# EAGLE design 11153-SandyNoble-Polarshieldv1.0 (EAGLE 5.11)
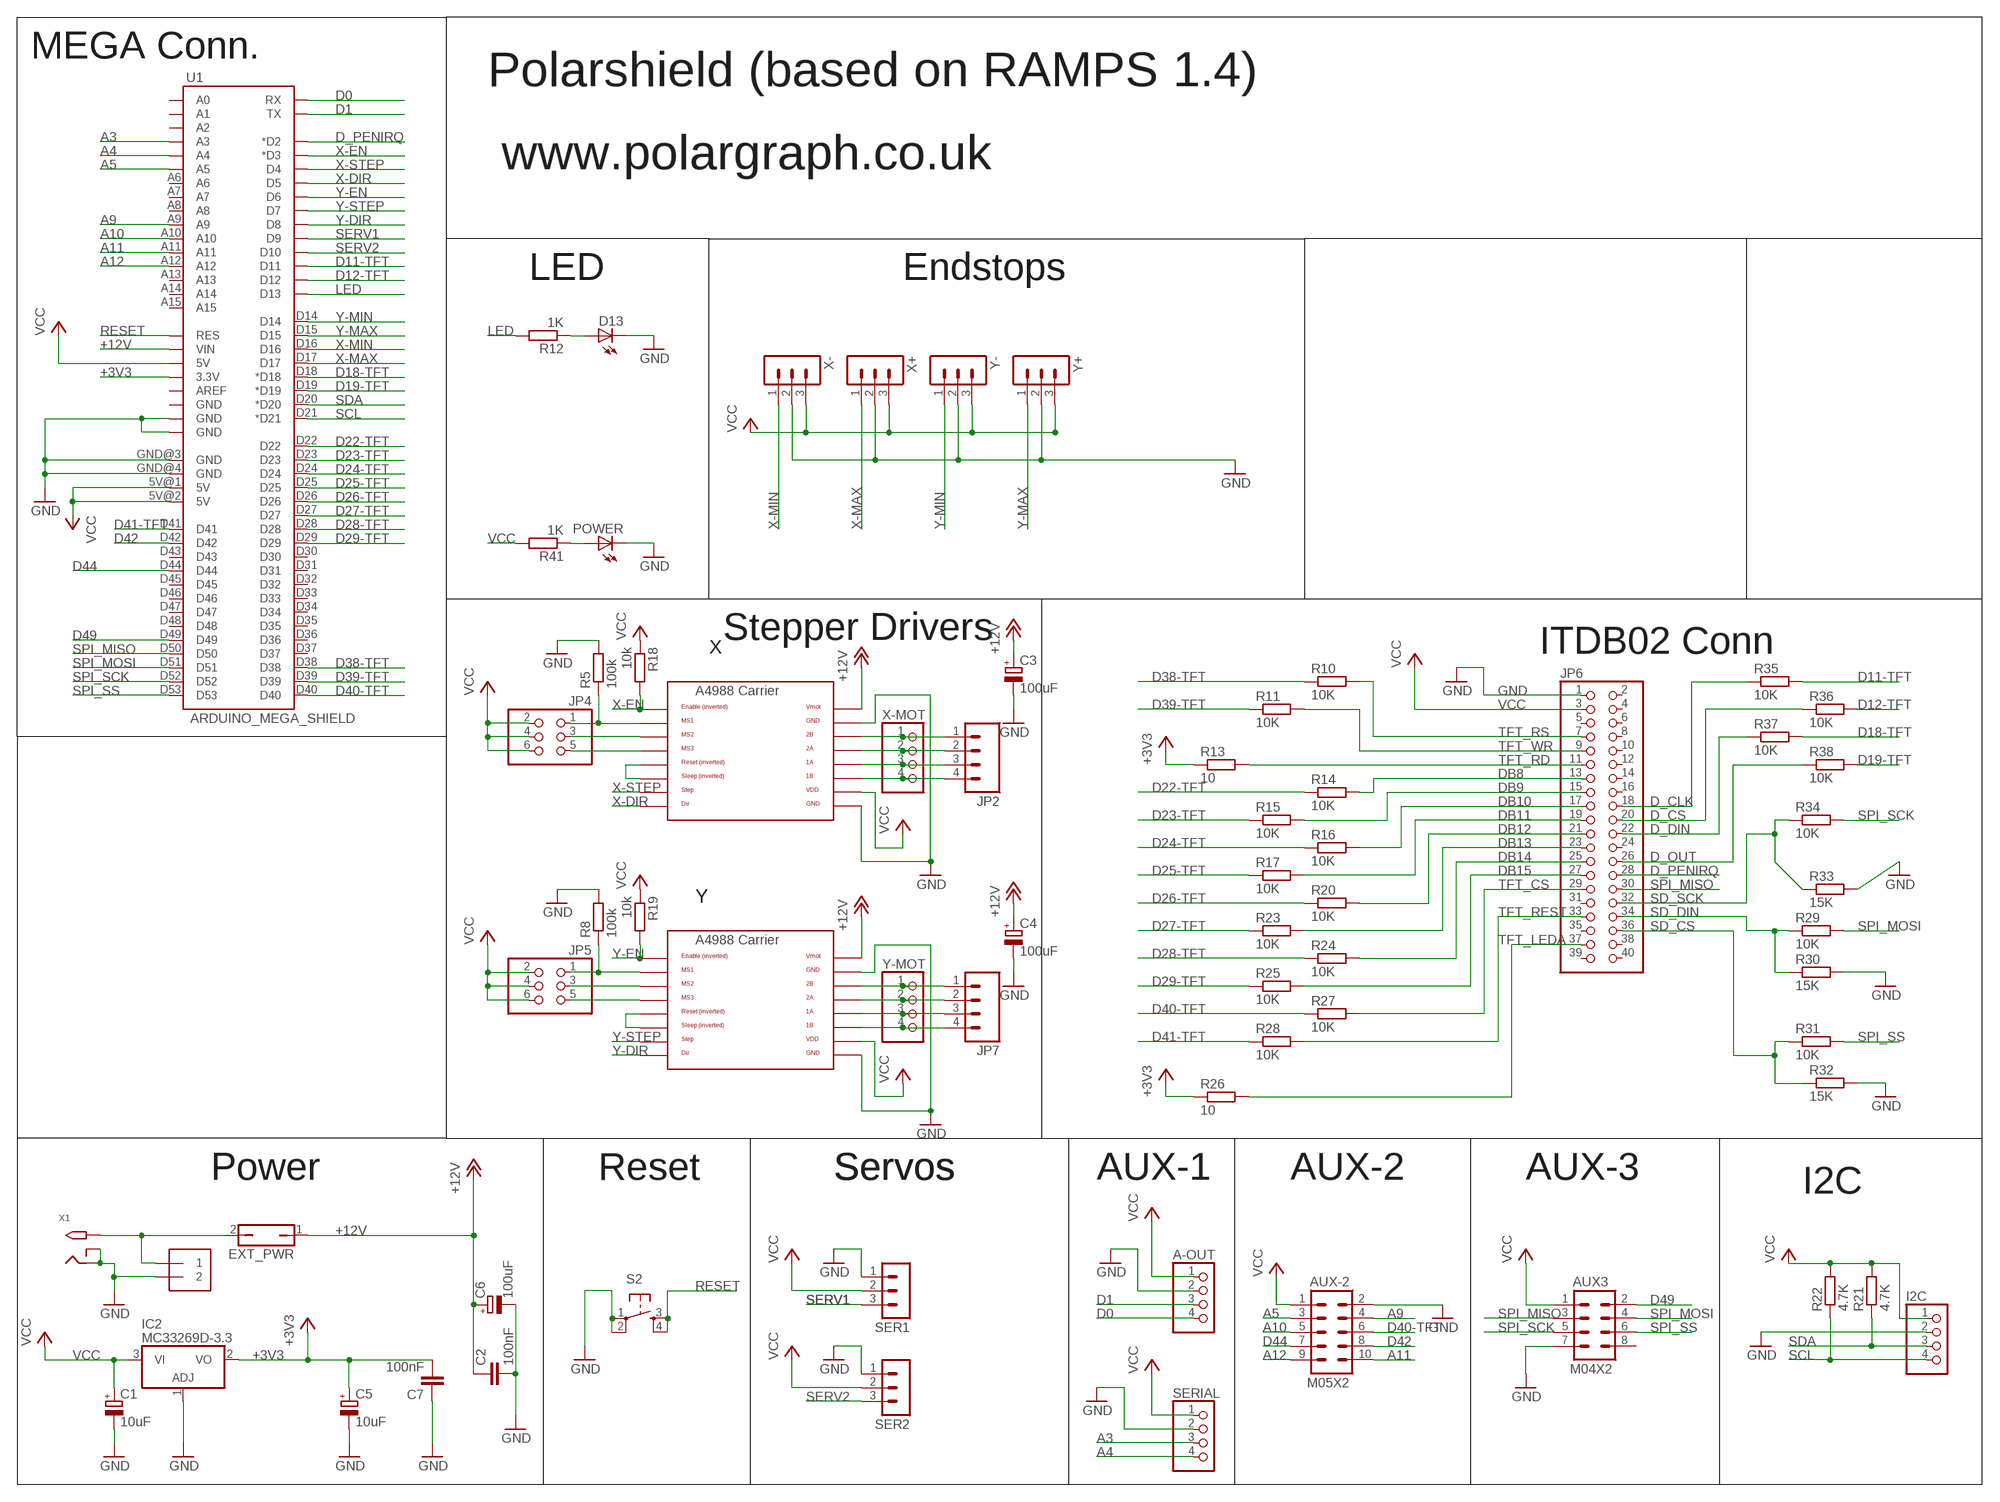
[diagram p0: schematic, sheet 1, part 1 of 2]
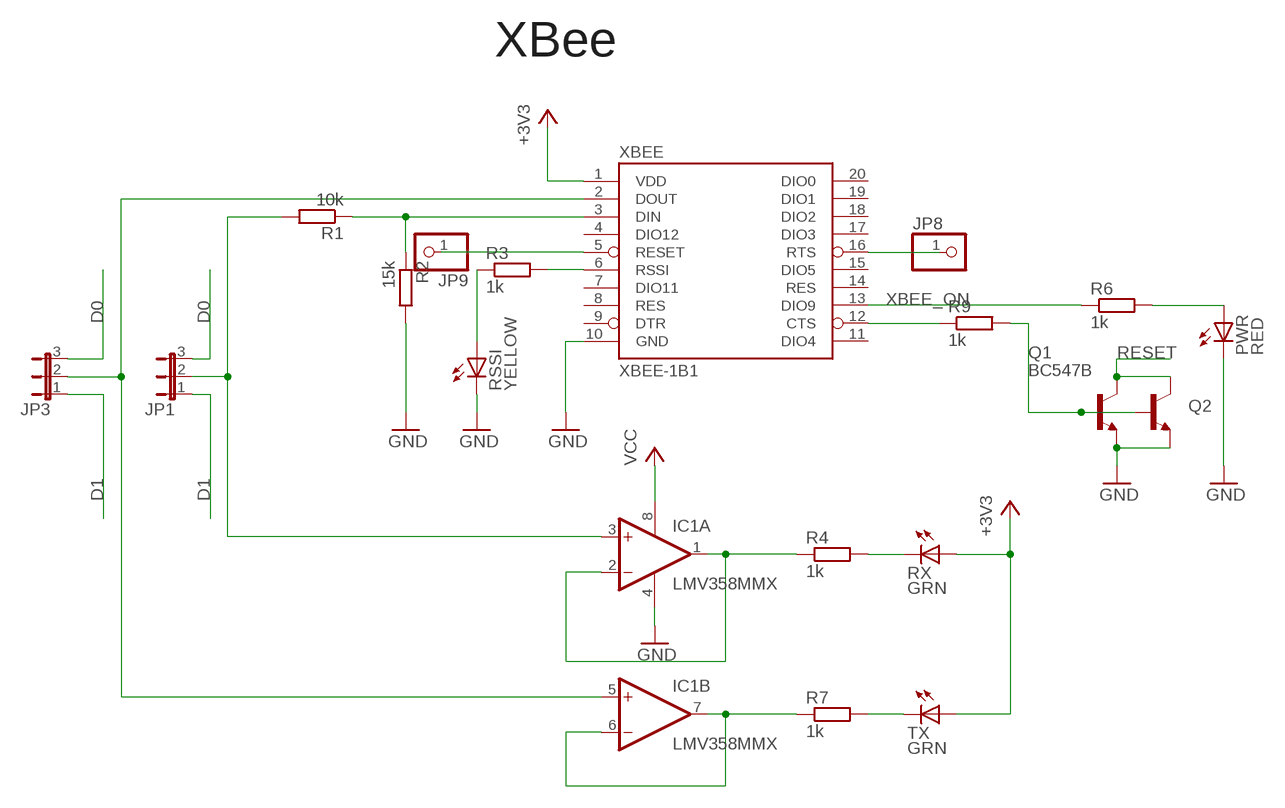
[diagram p1: schematic, sheet 1, part 2 of 2]

## Parts
A-OUT  PINHD-1X4  [1X04]
AUX3  M04X2  [2X4]
AUX-2  M05X2  [2X5]
C1  10uF  CPOL-EUCT3528  [CT3528]
C2  100nF  C-EUC0805  [C0805]
C3  100uF  CPOL-EU153CLV-0605  [153CLV-0605]
C4  100uF  CPOL-EU153CLV-0605  [153CLV-0605]
C5  10uF  CPOL-EUCT3528  [CT3528]
C6  100uF  CPOL-EU153CLV-0605  [153CLV-0605]
C7  100nF  C-EUC0805  [C0805]
D13  LEDCHIP-LED0805  [CHIP-LED0805]
EXT_PWR  JP1Q  [JP1]
I2C  PINHD-1X4  [1X04]
IC1  LMV358MMX  [MSOP08]
IC2  MC33269D-3.3  [DPACK]
J1  1X2-3.5MM  [1X2-3.5MM]
JP1  JP2E  [JP2]
JP2  M04SCREW  [SCREWTERMINAL-3.5MM-4]
JP3  JP2E  [JP2]
JP4  PINHD-2X3  [2X03]
JP5  PINHD-2X3  [2X03]
JP6  PINHD-2X20  [2X20]
JP7  M04SCREW  [SCREWTERMINAL-3.5MM-4]
JP8  PINHD-1X1  [1X01]
JP9  PINHD-1X1  [1X01]
POWER  LEDCHIP-LED0805  [CHIP-LED0805]
PWR  RED  LEDCHIPLED_0805  [CHIPLED_0805]
Q1  BC547B  [TO92]
Q2  TRANSISTOR_NPNSOT23  [SOT23]
R1  10k  R-EU_R0805  [R0805]
R2  15k  R-EU_R0805  [R0805]
R3  1k  R-EU_R0805  [R0805]
R4  1k  R-EU_R0805  [R0805]
R5  100k  R-EU_R0805  [R0805]
R6  1k  R-EU_R0805  [R0805]
R7  1k  R-EU_R0805  [R0805]
R8  100k  R-EU_R0805  [R0805]
R9  1k  R-EU_R0805  [R0805]
R10  10K  R-EU_R0805  [R0805]
R11  10K  R-EU_R0805  [R0805]
R12  1K  R-EU_R0805  [R0805]
R13  10  R-EU_R0805  [R0805]
R14  10K  R-EU_R0805  [R0805]
R15  10K  R-EU_R0805  [R0805]
R16  10K  R-EU_R0805  [R0805]
R17  10K  R-EU_R0805  [R0805]
R18  10k  R-EU_R0805  [R0805]
R19  10k  R-EU_R0805  [R0805]
R20  10K  R-EU_R0805  [R0805]
R21  4.7K  R-EU_R0805  [R0805]
R22  4.7K  R-EU_R0805  [R0805]
R23  10K  R-EU_R0805  [R0805]
R24  10K  R-EU_R0805  [R0805]
R25  10K  R-EU_R0805  [R0805]
R26  10  R-EU_R0805  [R0805]
R27  10K  R-EU_R0805  [R0805]
R28  10K  R-EU_R0805  [R0805]
R29  10K  R-EU_R0805  [R0805]
R30  15K  R-EU_R0805  [R0805]
R31  10K  R-EU_R0805  [R0805]
R32  15K  R-EU_R0805  [R0805]
R33  15K  R-EU_R0805  [R0805]
R34  10K  R-EU_R0805  [R0805]
R35  10K  R-EU_R0805  [R0805]
R36  10K  R-EU_R0805  [R0805]
R37  10K  R-EU_R0805  [R0805]
R38  10K  R-EU_R0805  [R0805]
R41  1K  R-EU_R0805  [R0805]
RSSI  YELLOW  LEDCHIPLED_0805  [CHIPLED_0805]
RX  GRN  LEDCHIPLED_0805  [CHIPLED_0805]
S2  TAC_SWITCHPTH  [TACTILE-PTH]
SER1  3PIN-HEADER  [3PIN-HEADER]
SER2  3PIN-HEADER  [3PIN-HEADER]
SERIAL  PINHD-1X4  [1X04]
TX  GRN  LEDCHIPLED_0805  [CHIPLED_0805]
U1  ARDUINO_MEGA_SHIELD  [ARDUINO_MEGA_SHIELD]
U$6  A4988BREAKOUT  [A4988BREAKOUT]
U$7  A4988BREAKOUT  [A4988BREAKOUT]
X1  2.1MMJACKTHM  [PJ-102A]
X+  3PIN-HEADER  [3PIN-HEADER]
X-  3PIN-HEADER  [3PIN-HEADER]
X-MOT  PINHD-1X4  [1X04]
XBEE  XBEE-1B1  [XBEE-1]
Y+  3PIN-HEADER  [3PIN-HEADER]
Y-  3PIN-HEADER  [3PIN-HEADER]
Y-MOT  PINHD-1X4  [1X04]

## Nets
+3V3: C5.+ C7.2 IC2.2(VO) R13.1 R26.1 RX.A TX.A U1.3.3V XBEE.1(VDD)
+12V [vcc]: C2.1 C3.+ C4.+ C6.+ EXT_PWR.1 U1.VIN U$6.VMOT U$7.VMOT
A3: SERIAL.3 U1.A3
A4: SERIAL.4 U1.A4
A5: AUX-2.3 U1.A5
A9: AUX-2.4 U1.A9
A10: AUX-2.5 U1.A10
A11: AUX-2.10 U1.A11
A12: AUX-2.9 U1.A12
D0: A-OUT.4 JP1.3 JP3.3 U1.RX
D1: A-OUT.3 JP1.1 JP3.1 U1.TX
D11-TFT: R35.2 U1.D11
D12-TFT: R36.2 U1.D12
D18-TFT: R37.2 U1.D18(*D18)
D19-TFT: R38.2 U1.D19(*D19)
D22-TFT: R14.1 U1.D22
D23-TFT: R15.1 U1.D23
D24-TFT: R16.1 U1.D24
D25-TFT: R17.1 U1.D25
D26-TFT: R20.1 U1.D26
D27-TFT: R23.1 U1.D27
D28-TFT: R24.1 U1.D28
D29-TFT: R25.1 U1.D29
D38-TFT: R10.1 U1.D38
D39-TFT: R11.1 U1.D39
D40-TFT: AUX-2.6 R27.1 U1.D40
D41-TFT: R28.1 U1.D41
D42: AUX-2.8 U1.D42
D44: AUX-2.7 U1.D44
D49: AUX3.2 U1.D49
D_CLK: JP6.18 R35.1
D_CS: JP6.20 R36.1
D_DIN: JP6.22 R37.1
D_OUT: JP6.26 R38.1
D_PENIRQ: JP6.28 U1.D2(*D2)
DB8: JP6.13 R14.2
DB9: JP6.15 R15.2
DB10: JP6.17 R16.2
DB11: JP6.19 R17.2
DB12: JP6.21 R20.2
DB13: JP6.23 R23.2
DB14: JP6.25 R24.2
DB15: JP6.27 R25.2
GND: A-OUT.2 AUX3.7 AUX-2.2 C1.- C2.2 C3.- C4.- C5.- C6.- C7.1 D13.C I2C.2 IC1.4(P:V-) IC2.1(ADJ) J1.2 JP6.1 POWER.C PWR.C Q1.1(E) Q2.2(E) R2.2 R5.2 R8.2 R30.2 R32.2 R33.2 RSSI.C S2.1 S2.2 SER1.1 SER2.1 SERIAL.2 U1.GND@0(GND) U1.GND@1(GND) U1.GND@3(GND) U1.GND@4(GND) U$6.GND U$6.GND@0(GND) U$7.GND U$7.GND@0(GND) X1.RING X1.RING_SW X+.2 X-.2 XBEE.10(GND) Y+.2 Y-.2
LED: R12.2 U1.D13
N$1: U$6.RST U$6.SLP(SLEEP)
N$2: POWER.A R41.1
N$3: EXT_PWR.2 J1.1 X1.TIP
N$4: R7.2 TX.C
N$5: R3.1 RSSI.A
N$6: IC1.6(B:-IN) IC1.7(B:OUT) R7.1
N$7: PWR.A R6.2
N$8: R3.2 XBEE.6(RSSI)
N$9: IC1.1(A:OUT) IC1.2(A:-IN) R4.1
N$10: R9.1 XBEE.12(CTS)
N$11: R4.2 RX.C
N$12: Q1.2(B) Q2.1(B) R9.2
N$13: U$7.RST U$7.SLP(SLEEP)
N$14: JP4.1 R5.1 U$6.MS1
N$15: JP4.3 U$6.MS2
N$16: IC1.3(A:+IN) JP1.2 R1.2
N$17: JP5.3 U$7.MS2
N$18: JP9.1 XBEE.5(RESET)
N$19: JP4.5 U$6.MS3
N$20: JP8.1 XBEE.16(RTS)
N$21: JP2.1 U$6.2B X-MOT.1
N$22: JP2.2 U$6.2A X-MOT.2
N$24: IC1.5(B:+IN) JP3.2 XBEE.2(DOUT)
N$26: JP2.3 U$6.1A X-MOT.3
N$27: JP2.4 U$6.1B X-MOT.4
N$28: JP7.1 U$7.2B Y-MOT.1
N$29: JP7.2 U$7.2A Y-MOT.2
N$30: JP7.3 U$7.1A Y-MOT.3
N$31: JP5.5 U$7.MS3
N$32: R1.1 R2.1 XBEE.3(DIN)
N$33: JP5.1 R8.1 U$7.MS1
N$36: JP7.4 U$7.1B Y-MOT.4
N$46: D13.A R12.1
RESET: Q1.3(C) Q2.3(C) S2.3 S2.4 U1.RES
SCL: I2C.4 R22.1 U1.D21(*D21)
SD_CS: JP6.36 R31.1 R32.1
SD_DIN: JP6.34 R29.1 R30.1
SD_SCK: JP6.32 R33.1 R34.1
SDA: I2C.3 R21.1 U1.D20(*D20)
SERV1: SER1.3 U1.D9
SERV2: SER2.3 U1.D10
SPI_MISO: AUX3.3 JP6.30 U1.D50
SPI_MOSI: AUX3.4 R29.2 U1.D51
SPI_SCK: AUX3.5 R34.2 U1.D52
SPI_SS: AUX3.6 R31.2 U1.D53
TFT_CS: JP6.29 R27.2
TFT_LEDA: JP6.37 R26.2
TFT_RD: JP6.11 R13.2
TFT_REST: JP6.33 R28.2
TFT_RS: JP6.7 R10.2
TFT_WR: JP6.9 R11.2
VCC: A-OUT.1 AUX3.1 AUX-2.1 C1.+ I2C.1 IC1.8(P:V+) IC2.3(VI) JP4.2 JP4.4 JP4.6 JP5.2 JP5.4 JP5.6 JP6.3 R18.1 R19.1 R21.2 R22.2 R41.2 SER1.2 SER2.2 SERIAL.1 U1.5V@0(5V) U1.5V@1(5V) U1.5V@2(5V) U$6.VDD U$7.VDD X+.3 X-.3 Y+.3 Y-.3
X-DIR: U1.D5 U$6.DIR
X-EN: R18.2 U1.D3(*D3) U$6.EN
X-MAX: U1.D17 X+.1
X-MIN: U1.D16 X-.1
X-STEP: U1.D4 U$6.STEP
XBEE_ON: R6.1 XBEE.13(DIO9)
Y-DIR: U1.D8 U$7.DIR
Y-EN: R19.2 U1.D6 U$7.EN
Y-MAX: U1.D15 Y+.1
Y-MIN: U1.D14 Y-.1
Y-STEP: U1.D7 U$7.STEP
Unconnected: AUX3.8 JP6.2 JP6.4 JP6.5 JP6.6 JP6.8 JP6.10 JP6.12 JP6.14 JP6.16 JP6.24 JP6.31 JP6.35 JP6.38 JP6.39 JP6.40 U1.A0 U1.A1 U1.A2 U1.A6 U1.A7 U1.A8 U1.A13 U1.A14 U1.A15 U1.AREF U1.D30 U1.D31 U1.D32 U1.D33 U1.D34 U1.D35 U1.D36 U1.D37 U1.D43 U1.D45 U1.D46 U1.D47 U1.D48 U1.GND@2(GND) XBEE.4(DIO12) XBEE.7(DIO11) XBEE.8(RES) XBEE.9(DTR) XBEE.11(DIO4) XBEE.14(RES) XBEE.15(DIO5) XBEE.17(DIO3) XBEE.18(DIO2) XBEE.19(DIO1) XBEE.20(DIO0)

## Notes on the sheet
- MEGA Conn.
- Polarshield (based on RAMPS 1.4)
- www.polargraph.co.uk
- LED | Endstops
- XBee
- Stepper Drivers
- X | ITDB02 Conn
- Y
- Power | Reset | Servos | Servos | AUX-1 | AUX-2 | AUX-3
- I2C

## Library data of the parts
A-OUT I2C SERIAL X-MOT Y-MOT = RepRapjr:PINHD-1X4: PIN HEADER
AUX3 = SparkFun:M04X2
AUX-2 = RepRapjr:M05X2
C1 C3-C6 = rcl:CPOL-EU: POLARIZED CAPACITOR, European symbol
C2 C7 = resistor:C-EU: CAPACITOR, European symbol
D13 POWER PWR RSSI RX TX = led:LED: LED OSRAM: - CHIPLED LG R971, LG N971, LY N971, LG Q971, LY Q971, LO R971, LY R971 LH N974, LH R974 LS Q976, LO Q976, LY Q976 LO Q996 - Hyper CHIPLED LW Q18S LB Q993, LB Q99A, LB R99A - SideLED LS A670, LO A670, LY A670, LG A670, LP A670 LB A673, LV A673, LT A673, LW A673 LH A674 LY A675 LS A676, LA A676, LO A676, LY A676, LW A676 LS A679, LY A679, LG A679 - Hyper Micro SIDELED® LS Y876, LA Y876, LO Y876, LY Y876 LT Y87S - SmartLED LW L88C, LW L88S LB L89C, LB L89S, LG L890 LS L89K, LO L89K, LY L89K LS L896, LA L896, LO L896, LY L896 - TOPLED LS T670, LO T670, LY T670, LG T670, LP T670 LSG T670, LSP T670, LSY T670, LOP T670, LYG T670 LG T671, LOG T671, LSG T671 LB T673, LV T673, LT T673, LW T673 LH T674 LS T676, LA T676, LO T676, LY T676, LB T676, LH T676, LSB T676, LW T676 LB T67C, LV T67C, LT T67C, LS T67K, LO T67K, LY T67K, LW E67C LS E67B, LA E67B, LO E67B, LY E67B, LB E67C, LV E67C, LT E67C LW T67C LS T679, LY T679, LG T679 LS T770, LO T770, LY T770, LG T770, LP T770 LB T773, LV T773, LT T773, LW T773 LH T774 LS E675, LA E675, LY E675, LS T675 LS T776, LA T776, LO T776, LY T776, LB T776 LHGB T686 LT T68C, LB T68C - Hyper Mini TOPLED® LB M676 - Mini TOPLED Santana® LG M470 LS M47K, LO M47K, LY M47K Source: http://www.osram.convergy.de LUXEON: - LUMILED® LXK2-PW12-R00, LXK2-PW12-S00, LXK2-PW14-U00, LXK2-PW14-V00 LXK2-PM12-R00, LXK2-PM12-S00, LXK2-PM14-U00 LXK2-PE12-Q00, LXK2-PE12-R00, LXK2-PE12-S00, LXK2-PE14-T00, LXK2-PE14-U00 LXK2-PB12-K00, LXK2-PB12-L00, LXK2-PB12-M00, LXK2-PB14-N00, LXK2-PB14-P00, LXK2-PB14-Q00 LXK2-PR12-L00, LXK2-PR12-M00, LXK2-PR14-Q00, LXK2-PR14-R00 LXK2-PD12-Q00, LXK2-PD12-R00, LXK2-PD12-S00 LXK2-PH12-R00, LXK2-PH12-S00 LXK2-PL12-P00, LXK2-PL12-Q00, LXK2-PL12-R00 Source: www.luxeon.com KINGBRIGHT: KA-3528ASYC Source: www.kingbright.com
EXT_PWR = jumper:JP1Q: JUMPER
IC1 = linear:LMV358?*: Dual General Purpose, Low Voltage, Rail-to-Rail Output Operational Amplifiers Source: http://www.national.com/mpf/LM/LMV321.html http://www.national.com/dt/lmv_qual.pdf
IC2 = linear:MC33269?*: Adjustable Output Low Dropout Voltage Regulator 800 mA Source: http://www.onsemi.com/pub/Collateral/MC33269-D.PDF
J1 = adafruit:1X2: 3.5mm Terminal block http://www.ladyada.net/library/pcb/eaglelibrary.html
JP1 JP3 = jumper:JP2E: JUMPER
JP2 JP7 = SparkFun:M04: Header 4 Standard 4-pin 0.1" header. Use with straight break away headers (SKU : PRT-00116), right angle break away headers (PRT-00553), swiss pins (PRT-00743), machine pins (PRT-00117), and female headers (PRT-00115). Molex polarized connector foot print use with SKU : PRT-08231 with associated crimp pins and housings. 1MM SMD Version SKU: PRT-10208
JP4 JP5 = pinhead:PINHD-2X3: PIN HEADER
JP6 = pinhead:PINHD-2X20: PIN HEADER
JP8 JP9 = adafruit:PINHD-1X1: Pin header 1x1 for 0.1" spacing With round pins
Q1 = transistor-npn:BC547*: NPN Transistor
Q2 = SparkFun:TRANSISTOR_NPN: Transistor NPN BJT configuration in SOT23 package. MMBT2222 is the common NPN we use. Double check BCE configuration again layout.
R1 R2 R5 R8 R12 R18 R19 R21 R22 R41 = rcl:R-EU_: RESISTOR, European symbol
R3 R4 R6 R7 R9-R11 R13-R17 R20 R23-R38 = resistor:R-EU_: RESISTOR, European symbol
S2 = SparkFun:TAC_SWITCH: Momentary Switch Button commonly used for reset or general input. Spark Fun Electronics SKU : COM-00097
SER1 SER2 X+ X- Y+ Y- = ultimachine:3PIN-HEADER: PIN HEADER
U1 = RepRapjr:ARDUINO_MEGA_SHIELD
U$6 U$7 = RepRapjr:A4988BREAKOUT
X1 = adafruit:2.1MMJACK: 2.1mm x 5.5mm THM DC jack with internal switch. Digikey part #PJ-102A, 4UCON part #05537 2.1mm x 5.5mm SMT DC jack with internal switch. Digikey part #PJ-002A-SMT, 4UCON part #03267 By microbuilder.eu & adafruit.com
XBEE = SparkFun:XBEE-1

## Net classes
1 gnd12: width 2.54 mm
2 gnd5: width 2.54 mm
3 vmot: width 2.54 mm
4 vcc: width 0.406 mm
5 signal: width 0.406 mm

## Board
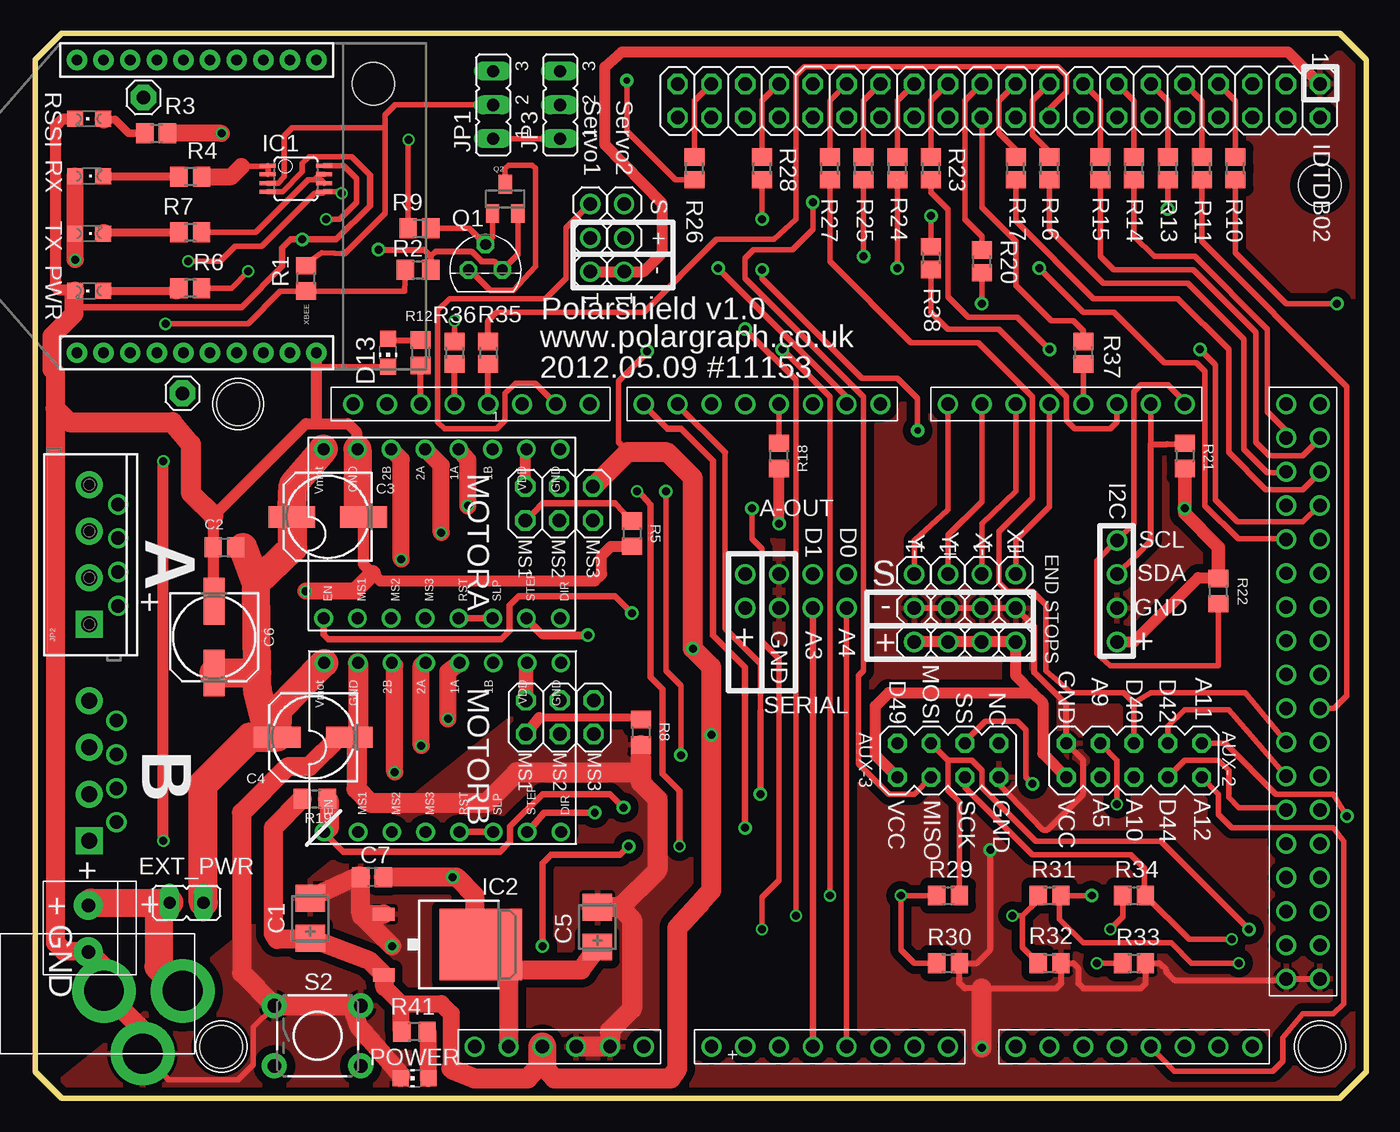
[diagram p2: board, top side]
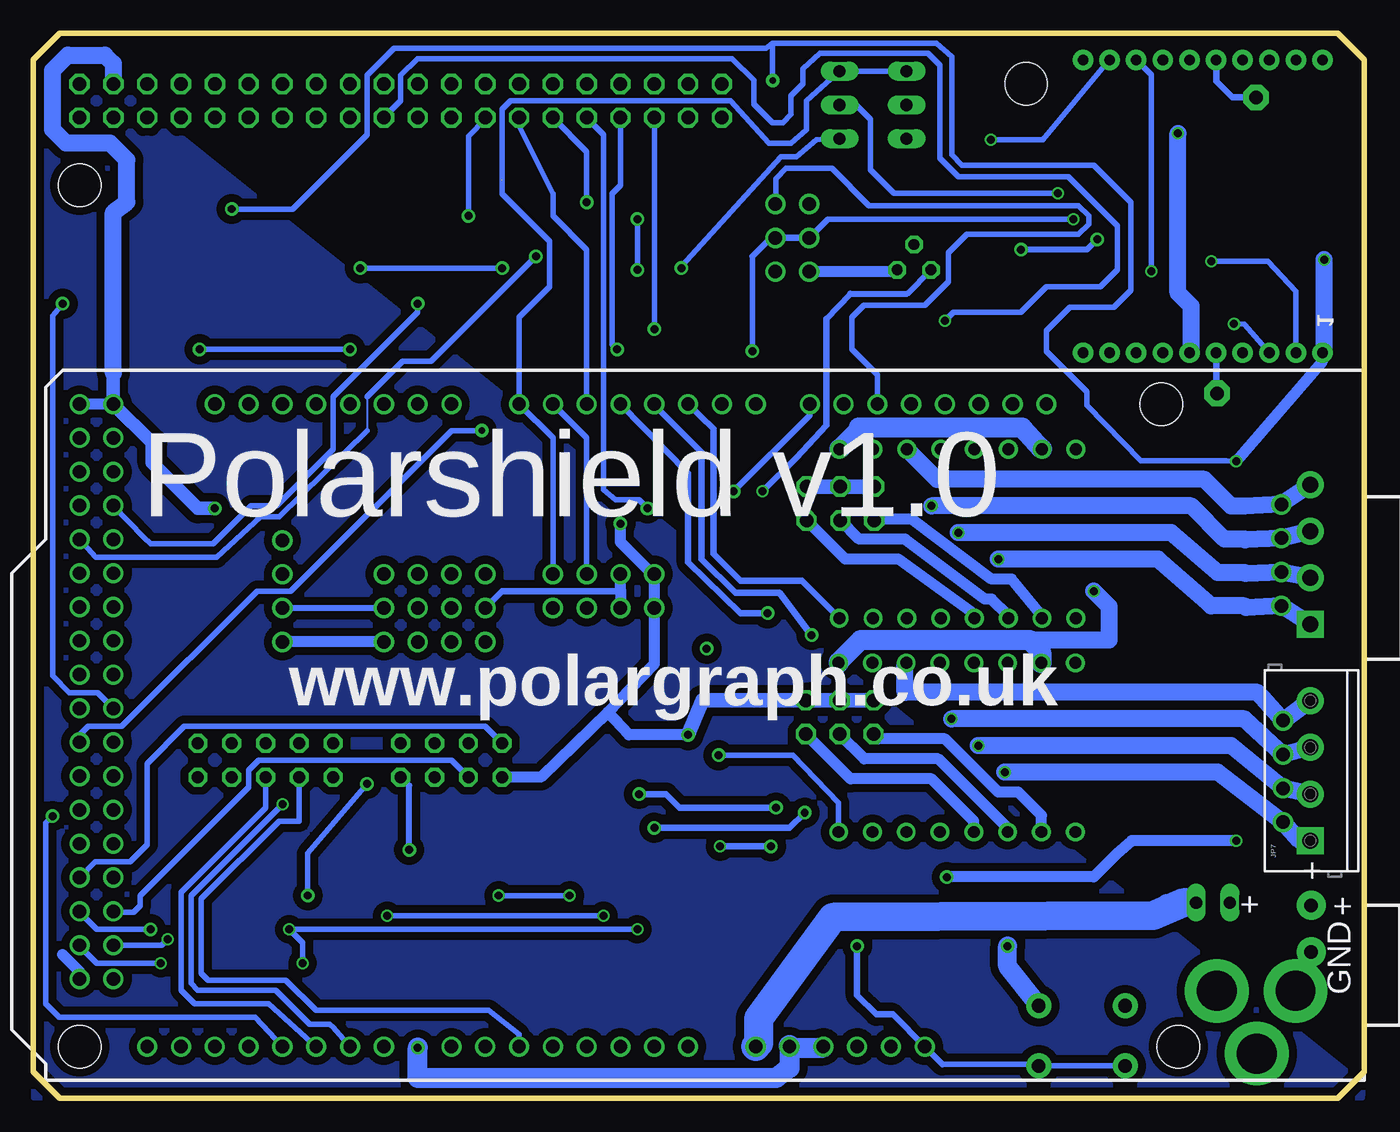
[diagram p3: board, bottom side, seen from below]

Size 100 x 80 mm. Coordinates in mm from the lower left corner, seen from the top.
Outline: 100,2 100,78 98,80 2,80 0,78 0,2 2,0 98,0 100,2
Copper layers (1*16): Top 0.035mm / dielectric 1.5mm / Bottom 0.035mm
Design rules "ITead_rule": minimum track width 6mil, minimum drill 12mil, track to track 6mil, track to pad 6mil, pad to pad 6mil, via to via 6mil, smd to smd 0mil, copper to edge 10mil, drill to drill 10mil, minimum pad ring 10mil, minimum via ring 6mil, stop-mask expansion 2mil, vias tented up to drill 100mil, thermal gap 10mil
Holes 3.2 mm at 25.4,76.2 96.52,68.58

### Footprints (pad centres in the part's own frame; a part is rotated, then mirrored left to right if it is on the bottom)
1X04 = drill 1.016 round: 1 -2.54,0; 2 0,0; 3 2.54,0; 4 5.08,0
2X4 = drill 0.9 pad 1.422 octagon: 1 -3.81,-1.27; 2 -3.81,1.27; 3 -1.27,-1.27; 4 -1.27,1.27; 5 1.27,-1.27; 6 1.27,1.27; 7 3.81,-1.27; 8 3.81,1.27
2X5 = drill 0.9 pad 1.422 octagon: 1 -3.81,-1.27; 2 -3.81,1.27; 3 -1.27,-1.27; 4 -1.27,1.27; 5 1.27,-1.27; 6 1.27,1.27; 7 3.81,-1.27; 8 3.81,1.27; 9 6.35,-1.27; 10 6.35,1.27
CT3528 = smd 2 x 2.2: + -1.5,0; - 1.5,0
C0805 = smd 1.3 x 1.5: 1 -0.85,0; 2 0.85,0
153CLV-0605 = smd 3.5 x 1.6: + 2.7,0; - -2.7,0
CHIP-LED0805 = smd 1.2 x 1.2: A 0,-1.05; C 0,1.05
JP1 = drill 0.914 long: 1 0,-1.27; 2 0,1.27
MSOP08 = smd 0.3 x 1.2: 1 -0.976,-2.113; 2 -0.326,-2.113; 3 0.324,-2.113; 4 0.974,-2.113; 5 0.974,2.112; 6 0.324,2.112; 7 -0.326,2.112; 8 -0.976,2.112
DPACK = smd 1 x 1.6: 1 -2.28,-4.8; 3 2.28,-4.8 | smd 5.4 x 6.2: 2 0,2.5
1X2-3.5MM = drill 1 pad 2.184 round: 1 1.8,0; 2 -1.7,0
JP2 = drill 0.914 long: 1 -2.54,0; 2 0,0; 3 2.54,0
SCREWTERMINAL-3.5MM-4 = drill 1.2 pad 2.032 square: 1 0,0 | drill 1.2 pad 2.032 round: 2 3.5,0; 3 7,0; 4 10.5,0
2X03 = drill 1.016 octagon: 1 -2.54,-1.27; 2 -2.54,1.27; 3 0,-1.27; 4 0,1.27; 5 2.54,-1.27; 6 2.54,1.27
2X20 = drill 1.016 octagon: 1 -24.13,-1.27; 2 -24.13,1.27; 3 -21.59,-1.27; 4 -21.59,1.27; 5 -19.05,-1.27; 6 -19.05,1.27; 7 -16.51,-1.27; 8 -16.51,1.27; 9 -13.97,-1.27; 10 -13.97,1.27; 11 -11.43,-1.27; 12 -11.43,1.27; 13 -8.89,-1.27; 14 -8.89,1.27; 15 -6.35,-1.27; 16 -6.35,1.27; 17 -3.81,-1.27; 18 -3.81,1.27; 19 -1.27,-1.27; 20 -1.27,1.27; 21 1.27,-1.27; 22 1.27,1.27; 23 3.81,-1.27; 24 3.81,1.27; 25 6.35,-1.27; 26 6.35,1.27; 27 8.89,-1.27; 28 8.89,1.27; 29 11.43,-1.27; 30 11.43,1.27; 31 13.97,-1.27; 32 13.97,1.27; 33 16.51,-1.27; 34 16.51,1.27; 35 19.05,-1.27; 36 19.05,1.27; 37 21.59,-1.27; 38 21.59,1.27; 39 24.13,-1.27; 40 24.13,1.27
1X01 = drill 1.016 pad 1.93 octagon: 1 0,0
CHIPLED_0805 = smd 1.2 x 1.2: A 0,-1.05; C 0,1.05
TO92 = drill 0.813 octagon: 1 1.27,0; 2 0,1.905; 3 -1.27,0
SOT23 = smd 1 x 1.4: 1 -0.95,-1.1; 2 0.95,-1.1; 3 0,1.1
R0805 = smd 1.3 x 1.5: 1 -0.95,0; 2 0.95,0
R0805' = smd 1.3 x 1.5: 1 -0.85,0; 2 0.85,0
TACTILE-PTH = drill 1.016 pad 1.88 round: 1 -3.251,2.261; 2 3.251,2.261; 3 -3.251,-2.261; 4 3.251,-2.261
3PIN-HEADER = drill 1.016 round: 1 -2.54,0; 2 0,0; 3 2.54,0
ARDUINO_MEGA_SHIELD = drill 1 pad 1.422 round: 3.3V 35.56,2.54; 5V@0 38.1,2.54; 5V@1 93.98,50.8; 5V@2 96.52,50.8; A0 50.8,2.54; A1 53.34,2.54; A2 55.88,2.54; A3 58.42,2.54; A4 60.96,2.54; A5 63.5,2.54; A6 66.04,2.54; A7 68.58,2.54; A8 73.66,2.54; A9 76.2,2.54; A10 78.74,2.54; A11 81.28,2.54; A12 83.82,2.54; A13 86.36,2.54; A14 88.9,2.54; A15 91.44,2.54; AREF 23.876,50.8; D2 58.42,50.8; D3 55.88,50.8; D4 53.34,50.8; D5 50.8,50.8; D6 48.26,50.8; D7 45.72,50.8; D8 41.656,50.8; D9 39.116,50.8; D10 36.576,50.8; D11 34.036,50.8; D12 31.496,50.8; D13 28.956,50.8; D14 68.58,50.8; D15 71.12,50.8; D16 73.66,50.8; D17 76.2,50.8; D18 78.74,50.8; D19 81.28,50.8; D20 83.82,50.8; D21 86.36,50.8; D22 93.98,48.26; D23 96.52,48.26; D24 93.98,45.72; D25 96.52,45.72; D26 93.98,43.18; D27 96.52,43.18; D28 93.98,40.64; D29 96.52,40.64; D30 93.98,38.1; D31 96.52,38.1; D32 93.98,35.56; D33 96.52,35.56; D34 93.98,33.02; D35 96.52,33.02; D36 93.98,30.48; D37 96.52,30.48; D38 93.98,27.94; D39 96.52,27.94; D40 93.98,25.4; D41 96.52,25.4; D42 93.98,22.86; D43 96.52,22.86; D44 93.98,20.32; D45 96.52,20.32; D46 93.98,17.78; D47 96.52,17.78; D48 93.98,15.24; D49 96.52,15.24; D50 93.98,12.7; D51 96.52,12.7; D52 93.98,10.16; D53 96.52,10.16; GND@0 40.64,2.54; GND@1 43.18,2.54; GND@2 26.416,50.8; GND@3 93.98,7.62; GND@4 96.52,7.62; RES 33.02,2.54; RX 63.5,50.8; TX 60.96,50.8; VIN 45.72,2.54 | hole 3.2: 96.52,2.54; 13.97,2.54; 15.24,50.8
A4988BREAKOUT = drill 0.9 round: 1A 8.89,1.27; 1B 11.43,1.27; 2A 6.35,1.27; 2B 3.81,1.27; DIR 16.51,-11.43; EN -1.27,-11.43; GND 16.51,1.27; GND@0 1.27,1.27; MS1 1.27,-11.43; MS2 3.81,-11.43; MS3 6.35,-11.43; RST 8.89,-11.43; SLP 11.43,-11.43; STEP 13.97,-11.43; VDD 13.97,1.27; VMOT -1.27,1.27
PJ-102A = drill 3 pad 4.8 round: RING 0.1,-3.39; RING_SW -4.6,-6.29; TIP 0.1,-9.29
XBEE-1 = drill 0.8 pad 1.524 round: 1 -11,20; 2 -11,18; 3 -11,16; 4 -11,14; 5 -11,12; 6 -11,10; 7 -11,8; 8 -11,6; 9 -11,4; 10 -11,2; 11 11,2; 12 11,4; 13 11,6; 14 11,8; 15 11,10; 16 11,12; 17 11,14; 18 11,16; 19 11,18; 20 11,20

### Placement (x,y rotation side)
A-OUT  55.88,39.37 0 top
AUX3  68.58,25.4 0 top
AUX-2  81.28,25.4 0 top
C1  20.67,13.53 90 top
C2  14.21,41.39 180 top
C3  21.97,43.68 180 top
C4  20.89,27.13 180 top
C5  42.23,12.86 90 top
C6  13.44,34.64 270 top
C7  25.31,16.62 0 top
D13  26.5,56 180 top
EXT_PWR  11.36,14.71 90 top
I2C  81.28,36.83 90 top
IC1  19.58,69.07 270 top
IC2  30.99,11.56 270 top
J1  3.99,12.7 90 top
JP1  34.38,74.62 90 top
JP2  4.06,35.6 90 top
JP3  39.42,74.62 90 top
JP4  39.36,44.68 0 top
JP5  39.41,28.63 0 top
JP6  72.39,74.93 180 top
JP7  4.06,19.36 90 bottom
JP8  8.13,75.18 0 top
JP9  11.05,52.96 0 top
POWER  28.5,1.5 90 top
PWR  4.04,60.65 90 top
Q1  33.82,62.23 0 top
Q2  35.31,67.56 0 top
R1  20.34,61.59 90 top
R2  28.76,62.23 0 top
R3  1k  [R0805']  9.09,72.48 0 top
R4  1k  [R0805']  11.65,69.23 180 top
R5  44.83,42.42 270 top
R6  1k  [R0805']  11.65,60.85 180 top
R7  1k  [R0805']  11.65,65.04 180 top
R8  45.5,27.5 270 top
R9  1k  [R0805']  28.86,65.35 0 top
R10  10K  [R0805']  90.17,69.85 90 top
R11  10K  [R0805']  87.63,69.85 90 top
R12  28.96,56.01 270 top
R13  10  [R0805']  85.09,69.85 90 top
R14  10K  [R0805']  82.55,69.85 90 top
R15  10K  [R0805']  80.01,69.85 90 top
R16  10K  [R0805']  76.2,69.85 90 top
R17  10K  [R0805']  73.66,69.85 90 top
R18  55.88,48.26 90 top
R19  21,22.5 0 top
R20  10K  [R0805']  71.12,62.87 90 top
R21  86.36,48.26 270 top
R22  88.9,38.1 90 top
R23  10K  [R0805']  67.31,69.85 90 top
R24  10K  [R0805']  64.77,69.85 90 top
R25  10K  [R0805']  62.23,69.85 90 top
R26  10  [R0805']  49.53,69.85 90 top
R27  10K  [R0805']  59.69,69.85 90 top
R28  10K  [R0805']  54.61,69.85 90 top
R29  10K  [R0805']  68.58,15.24 0 top
R30  15K  [R0805']  68.58,10.16 0 top
R31  10K  [R0805']  76.2,15.24 0 top
R32  15K  [R0805']  76.2,10.16 0 top
R33  15K  [R0805']  82.55,10.16 0 top
R34  10K  [R0805']  82.55,15.24 0 top
R35  10K  [R0805']  34.04,56.01 270 top
R36  10K  [R0805']  31.5,56.01 270 top
R37  10K  [R0805']  78.74,56.01 270 top
R38  10K  [R0805']  67.31,63.12 270 top
R41  28.49,5 180 top
RSSI  4.04,73.58 90 top
RX  4.04,69.27 270 top
S2  21.21,4.7 0 top
SER1  41.7,64.63 90 top
SER2  44.24,64.64 90 top
SERIAL  55.88,36.83 0 top
TX  4.04,64.96 270 top
U1  0,1.35 0 top
U$6  22.93,47.49 0 top
U$7  22.98,31.44 0 top
X1  1.77,7.97 90 top
X+  73.66,36.83 270 top
X-  71.12,36.83 270 top
X-MOT  6.22,39.54 90 top
XBEE  23.13,67 90 top
Y+  68.58,36.83 270 top
Y-  66.04,36.83 270 top
Y-MOT  6.1,23.29 90 top

### Tracks (layer width: path | path; a pad name or v marks a point on that pad's centre or on a via)
+3V3  (via drill 0.5 pad 1.02, 0.6, 0.6 pad 1.02)
  Top 0.406: v85.09,66.8 R13.1 | R26.1 48.09,69 44.45,72.64 v44.45,76.45
  Top 0.813: v9.63,19.36 v9.63,47.86
  Top 1.27: v3,63 v2.99,63.01 TX.A RX.A
  Top 1.422: 35.56,10.16 U1.3.3V | 35.56,10.16 34.88,10.16 IC2.2 33.02,12.03 33.02,15.24 31.64,16.62 v31.37,16.62 C7.2 | C5.+ 41.02,9.65 36.07,9.65 35.56,10.16
  Bottom 0.406: v9.63,47.86 10.41,47.88 16.76,47.88 20.83,52.07 20.83,53.09 23.88,56.13 23.88,57.66 22.1,59.44 18.8,59.44 17.53,60.71 17.53,67.31 20.32,70.1 30.23,70.1 30.99,70.87 30.99,78.23 32.13,79.25 44.45,79.25 | v85.09,66.8 80.52,66.8 74.93,72.39 74.93,76.83 72.9,78.87 44.96,78.87 44.45,79.25 | 44.45,79.25 v44.45,76.45
  Bottom 0.813: XBEE.1 3.13,55.37 v9.63,47.86 | v9.63,19.36 17.48,19.36 18.58,18.38 20.32,16.64 31.35,16.64 v31.37,16.62
  Bottom 1.27: v3,63 3,56.13 XBEE.1
+12V
  Top 1.27: 17.5,27.13 17.56,27.19 | C3.+ 20.06,43.89 | 15.61,41.39 C2.1
  Top 1.676: 19.35,43.68 C3.+
  Top 2.1: 18.21,29.16 U$7.VMOT | 16.67,30.74 16.66,32.01 16.61,38.74
  Top 2.184: 18.21,29.16 C4.+ 17.5,27.13 16.13,27.13 12.6,23.6 EXT_PWR.1 | U$6.VMOT 19.37,46.09 C3.+ | 17.56,27.19 16.67,30.74 | 19.35,43.68 19.35,41.35 16.61,38.74 15.61,41.39 | C6.+ 16.59,31.94 16.66,32.01
  Bottom 1.422: 13.46,14.73 14.86,14.63 EXT_PWR.1
  Bottom 2.184: U1.VIN 45.5,4.17 45.5,6 39.93,13.6 15.89,13.73 15.86,13.73 13.46,14.73
A3
  Top 0.5: U1.A3 SERIAL.3
  Bottom 0.152: U1.A3 58.42,3.81
A4
  Top 0.406: U1.A4 SERIAL.4
A5
  Bottom 0.406: U1.A5 63.5,4.83 65.79,6.6 78.74,6.6 81.03,8.89 86.87,8.89 87.38,9.4 87.38,14.99 81.53,20.83 80.01,20.83 AUX-2.3
A9  (via drill 0.6)
  Top 0.406: v81.28,22.1 81.28,25.4 AUX-2.4
  Bottom 0.406: U1.A9 77.47,5.33 77.72,5.59 79.25,5.59 81.79,8.13 87.63,8.13 88.14,8.64 88.14,15.24 v81.28,22.1
A10
  Bottom 0.406: U1.A10 82.3,7.11 87.88,7.11 88.9,8.13 88.9,15.49 82.55,21.84 AUX-2.5
A11  (via drill 0.6 pad 1.02)
  Top 0.406: AUX-2.10 89.41,26.67 93.22,22.86 97.54,22.86 v98.55,21.21
  Bottom 0.406: v98.55,21.21 99.06,20.7 99.06,19.68 99.06,7.11 98.04,6.1 83.31,6.1 U1.A11
A12
  Top 0.406: AUX-2.9 88.9,22.86 88.9,21.34 89.92,20.32 97.54,20.32 98.3,19.3 98.3,7.11 97.54,6.35 95.25,6.35 93.73,4.57 93.73,2.79 92.96,2.03 85.6,2.03 U1.A12
D0
  Bottom 0.406: JP1.3 JP3.3 40.77,75.95 41.91,74.93 41.91,72.77 43.05,71.75 44.7,71.75 47.62,74.93 64.14,74.93 64.77,74.3 64.77,67.94 61.21,64.39 61.21,60.96 63.5,58.67 U1.RX 60.96,49.61 A-OUT.4
D1  (via drill 0.6 pad 1.02)
  Top 0.406: JP3.1 JP1.1 | v51.31,62.36 60.96,52.7 U1.TX
  Bottom 0.406: A-OUT.3 58.42,49.61 U1.TX | v51.31,62.36 51.31,62.48 43.81,70.74 42.67,70.74 41.15,72.01 JP3.1
D11-TFT
  Top 0.457: U1.D11 R35.2
D12-TFT
  Top 0.457: U1.D12 R36.2
D18-TFT
  Top 0.406: U1.D18 R37.2
D19-TFT
  Top 0.406: R38.2 67.31,59.05 68.58,57.78 72.39,57.78 77.47,52.7 77.47,50.93 78.11,50.29 80.77,50.29 81.28,50.8 U1.D19
D22-TFT
  Top 0.406: R14.1 82.55,64.77 84.07,63.25 87.12,63.25 92.58,57.78 92.58,51.56 93.98,50.16 U1.D22
D23-TFT
  Top 0.152: 96.52,49.53 U1.D23
  Top 0.406: 96.52,49.53 95.25,48.26 92.71,48.26 91.69,49.28 91.69,57.53 87,62.23 81.03,62.23 80.01,63.25 R15.1
D24-TFT
  Top 0.152: 93.98,46.99 U1.D24
  Top 0.406: 93.98,46.99 92.58,46.99 90.81,48.77 90.81,57.02 86.61,61.21 80.26,61.21 76.2,65.28 R16.1
D25-TFT
  Top 0.406: R17.1 73.66,65.91 79.5,60.07 85.85,60.07 89.66,56.26 89.66,48.51 92.46,45.72 95.25,45.72 96.52,46.99 U1.D25
D26-TFT  (via drill 0.6 pad 1.02)
  Top 0.406: v71.12,59.69 R20.1
  Bottom 0.406: v71.12,59.69 71.12,59.05 77.47,52.7 77.47,48.77 81.71,44.53 83.61,44.53 86.49,41.66 91.19,41.66 91.69,42.16 U1.D26
D27-TFT  (via drill 0.6 pad 1.02)
  Top 0.406: R23.1 67.31,68.07 68.58,66.8 68.58,60.2 70.1,58.67 73.79,58.67 v76.2,56.26 | U1.D27 96.47,44.53 95.25,43.31 90.3,43.31 88.65,44.96 88.65,55.12 88.27,55.5 v87.5,56.26
  Bottom 0.406: v76.2,56.26 v87.5,56.26
D28-TFT  (via drill 0.6 pad 1.02)  (1 unrouted)
  Top 0.406: v75.44,62.36 78.74,59.05 81.03,59.05 84.84,55.24 87.25,55.24 87.88,54.61 87.88,44.53 90.38,42.04 93.98,42.04 U1.D28 | v64.77,62.36 64.77,68.96
  Bottom 0.406: v64.77,62.36 v75.44,62.36
D29-TFT  (via drill 0.6 pad 1.02)
  Top 0.406: v62.23,63.25 R25.1
  Bottom 0.152: 74.93,52.7 74.93,50.16
  Bottom 0.406: v62.23,63.25 70.1,55.37 72.26,55.37 74.93,52.7 | 74.93,50.16 81.53,43.69 82.93,43.69 86.23,40.64 95.3,40.64 U1.D29
D38-TFT  (via drill 0.6 pad 1.02)
  Top 0.406: R10.1 90.17,63.5 93.98,59.69 v97.79,59.69
  Bottom 0.406: v97.79,59.69 98.55,58.8 98.55,31.75 97.28,30.48 95.17,30.48 U1.D38
D39-TFT
  Top 0.406: R11.1 87.63,64.39 98.55,53.47 98.55,30.23 97.62,29.29 U1.D39
D40-TFT
  Top 0.406: 73.03,38.1 74.93,38.1 75.95,37.08 75.95,32.13 77.85,30.48 81.79,30.48 82.55,29.72 | 73.03,38.1 72.9,38.1 | 82.55,29.72 AUX-2.6 | U1.D40 90.93,30.48 83.82,30.48 82.55,29.72 | 73.03,38.1 72.39,38.73 72.39,42.55 74.93,45.09 74.93,52.7 70.87,56.77 65.79,56.77 59.69,62.87 R27.1
D41-TFT  (via drill 0.5 pad 1.02, 0.6 pad 1.02)
  Top 0.406: v66.29,50.16 66.29,52.58 64.77,54.1 62.1,54.1 54.61,61.59 v54.61,62.23 | v54.61,66.04 R28.1
  Bottom 0.406: v54.61,62.23 v54.61,66.04 | v66.29,50.16 68.58,50.16 80.64,38.1 83.19,38.1 93.34,27.94 95.89,27.94 96.52,27.3 U1.D41
D42
  Top 0.406: AUX-2.8 85.09,27.94 86.36,29.21 89.66,29.21 U1.D42
D44
  Top 0.406: AUX-2.7 86.36,25.4 88.9,25.4 89.66,24.64 89.66,22.61 90.42,21.84 93.73,21.84 U1.D44
D49
  Bottom 0.406: U1.D49 95.33,17.78 92.71,17.78 91.44,19.05 91.44,25.15 88.65,27.94 66.04,27.94 AUX3.2
D_CLK
  Top 0.406: JP6.18 76.2,74.3 77.47,75.56 77.47,76.83 76.83,77.47 57.78,77.47 57.15,76.83 57.15,66.04 55.5,64.52 51.18,64.52 45.72,59.05 34.67,59.05 34.04,58.42
  Top 0.457: R35.1 34.04,58.42
D_CS  (via drill 0.6)
  Top 0.406: v31.5,58.42 R36.1
  Bottom 0.406: JP6.20 72.39,74.93 72.39,76.83 71.12,78.11 47.5,78.11 45.85,76.45 45.85,74.68 44.45,73.28 43.69,73.28 43.05,73.91 43.05,75.31 42.16,76.2 42.16,77.34 40.89,78.49 32.77,78.49 31.88,77.6 31.88,70.61 30.48,69.22 22.23,69.22 18.54,65.53 18.54,62.23 19.81,60.96 23.88,60.96 25.78,59.05 30.86,59.05 v31.5,58.42
D_DIN
  Top 0.406: JP6.22 71.12,66.93 73.66,64.39 73.66,61.09 76.33,58.42 77.98,58.42 78.74,57.66 R37.1
D_OUT  (via drill 0.6 pad 1.02)
  Top 0.406: R38.1 v67.31,66.29
  Bottom 0.406: JP6.26 66.04,73.53 67.31,72.26 v67.31,66.29
D_PENIRQ
  Bottom 0.152: 63.5,73.03 JP6.28
  Bottom 0.406: 63.5,73.03 60.96,67.94 60.96,66.29 58.42,63.75 U1.D2
DB8
  Top 0.406: R14.2 82.55,74.93 JP6.13
DB9
  Top 0.406: R15.2 80.01,74.93 JP6.15
DB10
  Top 0.406: JP6.17 74.93,74.93 74.93,72.39 76.2,71.12 R16.2
DB11
  Top 0.406: JP6.19 72.39,74.93 72.39,72.52 73.66,71.25 R17.2
DB12
  Top 0.406: JP6.21 69.85,74.93 69.85,66.04 71.12,64.77 R20.2
DB13
  Top 0.406: JP6.23 67.31,74.93 R23.2
DB14
  Top 0.406: JP6.25 64.77,74.93 R24.2
DB15
  Top 0.406: JP6.27 62.23,74.93 R25.2
GND  (via drill 0.6, 0.6 pad 1.02)
  Top 0.406: IC1.4 18.57,68.1 20.07,69.6 20.07,70.23 20.57,70.74 23.75,70.74 25.15,69.34 | 27.45,1.76 POWER.C | Q2.2 36.26,63.4 Q1.1 | 17.91,6.86 16.38,5.33 16.38,2.54 15.24,1.4 10.03,1.4 8,3.43
  Top 0.457: U1.GND@4 U1.GND@3 93.9,8.89 85.6,8.89 84.96,9.53 84.96,9.65 84.45,10.16 R33.2 83.44,10.12 83.44,8.64 83.06,8.26 78.74,8.26 78.36,8.64 78.36,9.78 77.98,10.16 R32.2 77.09,10.12 77.09,8.64 76.71,8.26 71.12,8.26 69.85,8.26 69.43,8.68 R30.2 70.74,10.16 71.75,11.18 v71.75,18.67 | AUX3.7 72.39,23.62 75.69,20.19 76.07,20.19 78.74,22.86 78.74,25.4 AUX-2.2 77.47,29.59 75.06,32 75.06,35.43 X+.2 X-.2 Y+.2 Y-.2 | D13.C 21.17,54.95 21.13,54.99 | R2.2 29.71,63.24 29.72,63.25 | 29.72,63.25 30.1,63.63 32.77,63.63 33.53,62.87 34.45,62.87 Q1.1 | v25.78,63.75 29.21,63.75 29.72,63.25
  Top 0.5: 25.15,69.34 25.15,67.06 22.61,64.52 v20.07,64.52 19.18,64.52 18.54,63.88 18.54,62.48 15.49,59.44 3.3,59.44 3.05,59.69 3.05,60.59 PWR.C
  Top 0.6: 45.5,25.65 45.37,25.53
  Top 0.813: SER1.1 SER2.1 45.71,62.09 47.12,63.5 47.12,67.18 42.8,71.63 42.8,77.47 44.07,78.61 94.11,78.61 JP6.1 | SER1.1 | R8.2 45.5,25.65 | 24.2,44.15 C3.- 24.64,43.65 24.64,40.13 25.34,39.43 25.91,38.86 42.04,38.86 42.55,39.37 42.55,40.77 43.25,41.47 R5.2 | C6.- 13.36,37.42 C2.2 13.36,43.71 13.4,43.75 20.32,50.67 21.34,50.67 | 21.34,50.67 23.5,50.67 24.13,50.04 24.13,48.83 U$6.GND@0 | XBEE.10 21.13,54.99 21.13,50.88 21.34,50.67 | RSSI.C 2.08,73.58 1.52,73.03 1.52,60.96 1.78,60.71 2.93,60.71 PWR.C | 45.47,24.51 45.5,24.55 | 23.95,27.49 24.13,27.3
  Top 1.1: C4.- 23.95,27.49 24.25,27.8
  Top 1.27: v20.32,38.1 24,38.1 25.34,39.43
  Top 1.422: C1.- 24.35,16.73 C7.1 24.46,13.89 24.51,13.84 | 24.51,13.84 IC2.1 | 27.45,1.76 24.26,5.46 23.75,6.88 S2.2 S2.1 15.49,9.42 15.49,21.46 18.92,24.89 20.57,24.89 22.81,27.13 C4.- | X1.RING_SW 8.06,5.17 X1.RING 5.16,9.86 J1.2 2.16,11.05 1.52,11.68 1.52,51.82 1.52,54.48 1.27,54.74 1.27,57.28 2.92,58.93 2.92,60.58 PWR.C | 24.51,13.84 24.51,13.72 v26.8,11.43
  Top 1.5: U1.GND@0 U1.GND@1 43.18,5.08 44.83,6.73 44.83,13.46 43.94,14.35 | 43.94,14.35 C5.- | 45.5,25.65 45.5,23.71 46.74,22.48 46.74,17.14 43.94,14.35 | U$7.GND@0 24.25,27.8 | 45.5,24.55 R8.2 | 45.47,24.51 36.2,24.51 33.91,22.23 25.15,22.23 24.13,23.24 24.13,27.3 | v71.12,3.81 71.12,8.26 | 13.4,43.75 11.68,45.47 11.68,49.15 10.29,50.8 2.54,50.8 1.52,51.82
  Top 2.1: U$6.GND@0 24.2,44.15
  Bottom 0.152: 43.18,3.94 43.18,4.45
  Bottom 0.457: v71.75,18.67 71.75,23.5 AUX3.7 | X+.2 I2C.2 | v25.78,63.75 20.83,63.75 v20.07,64.52
  Bottom 0.5: Y-.2 64.77,38.1 56.01,38.1 55.88,38.23
  Bottom 0.813: SER1.1 35.23,62.09 Q1.1 | SERIAL.2 55.88,38.23 A-OUT.2 | 97.79,10.79 96.52,9.53 U1.GND@4
  Bottom 1.27: 25.15,34.42 19.18,34.42 19.18,36.96 v20.32,38.1
  Bottom 1.422: v26.8,11.43 26.8,9.93 S2.2
  Bottom 1.5: U$6.GND@0 25.69,50.37 38,50.37 38,50.2 U$6.GND | U$7.GND 39.49,32.77 37.85,34.42 25.15,34.42 24.26,33.53 U$7.GND@0 | 43.05,3.81 40.64,3.81 | 43.18,3.94 U1.GND@1 43.18,2.29 44.2,1.52 71.12,1.52 v71.12,3.81
  Bottom 1.6: 43.18,3.94 43.05,3.81
  pour Top (isolate 0.61): 101,81 101,-1 -1,-1
LED
  Top 0.457: U1.D13 R12.2
N$1
  Top 0.5: U$6.RST U$6.SLP
N$2
  Top 1.27: POWER.A 29.54,4.9 R41.1
N$3
  Top 1.422: J1.1 4.19,14.71 | 11.06,8.12 X1.TIP | EXT_PWR.2 9.27,14.65
  Top 2.1: 4.19,14.71 EXT_PWR.2 | 11.06,8.12 9.27,9.91 9.27,14.65
N$4
  Top 0.61: 5.17,65.04 R7.2
  Top 1.27: TX.C 5.17,65.04
N$5
  Top 0.61: 5.17,73.5 5.97,73.53 6.99,72.52 R3.1
  Top 1.27: RSSI.A 5.17,73.5
N$6
  Top 0.406: R7.1 16.54,65.04 20.5,69 21,69 | 21,69 21.44,69 IC1.6 | IC1.7 21.4,69.4 21,69
N$7
  Top 0.61: PWR.A 10.6,60.65
  Top 1.27: 10.6,60.65 R6.2
N$8  (via drill 0.6)
  Top 1.27: v14,72.48 R3.2
  Bottom 1.27: v14,72.48 14,60.5 13,59.5 13,56.13 XBEE.6
N$9
  Top 0.406: 15.5,70 17.42,70 IC1.1 17.5,70.01 17.5,69.5 17.47,69.47 IC1.2
  Top 1.27: R4.1 14.73,69.23 15.5,70
N$10  (via drill 0.6)
  Top 0.406: R9.1 28.01,71.97 v28.04,72
  Bottom 0.406: v28.04,72 24.13,72 XBEE.12
N$11
  Top 0.61: RX.C 10.76,69.27
  Top 1.27: 10.76,69.27 R4.2
N$12
  Top 0.406: R9.2 32.6,65.35 Q1.2 34.36,64.67 Q2.1
N$13
  Top 0.5: U$7.RST U$7.SLP
N$14
  Top 0.406: 43.56,44.7 R5.1
  Top 0.5: 36.91,43.41 38.1,44.7 43.56,44.7
  Top 0.813: JP4.1 36.91,43.41
  Bottom 0.813: U$6.MS1 24.2,36.2 26.5,39 28,39 34,43.5 36.73,43.5 JP4.1
N$15
  Bottom 0.813: U$6.MS2 26.74,36.24 28,37.5 28.5,37.5 34.5,42 37.95,42 JP4.3
N$16
  Top 0.406: IC1.3 18.24,68.75 18.71,69.22 18.71,72.31 19.3,72.9 26.29,72.91 | 26.29,72.91 26.29,69.74 26.29,66.48 23.25,63.45 22.49,63.48 21.5,63.5 20.77,62.99 R1.2 | JP1.2 27.02,74.62 26.29,73.89 26.29,72.91
N$17
  Bottom 0.813: U$7.MS2 26.79,20.29 32,25.5 37.55,25.5 JP5.3
N$18
  Bottom 0.5: XBEE.5 11.13,53.04 JP9.1
N$19
  Bottom 0.813: U$6.MS3 29.56,36.56 35,40.5 38.99,40.5 JP4.5
N$20
  Bottom 0.5: XBEE.16 11.13,76.41 9.91,75.18 JP8.1
N$21  (via drill 0.6)
  Top 1.27: v27.5,40.5 27.5,48 U$6.2B
  Bottom 1.27: v27.5,40.5 15.5,40.5 11.5,37 9,37 8.87,36.87 X-MOT.1 JP2.1
N$22  (via drill 0.6)
  Top 1.27: v30.5,42.5 30.5,47.54 U$6.2A
  Bottom 1.27: v30.5,42.5 14.5,42.5 11,39.5 9,39.5 8.91,39.41 X-MOT.2 JP2.2
N$23
  pour Bottom (isolate 0.61): 98.7,80.09 99.95,79.22 99.95,0.03 0.14,0.03 0.03,1.03
N$24  (via drill 0.6)
  Top 0.406: v11.5,62.88 13.88,62.88 15,64 17,64 21,68 21.6,68 IC1.5 22.9,68.1 v23,68
  Bottom 0.406: XBEE.2 5.13,60.63 7.25,62.88 v11.5,62.88 | v23,68 35.35,68 37.08,69.73 37.08,73.53 38.17,74.62 JP3.2
N$26  (via drill 0.6)
  Top 1.27: v32.5,44.5 32.5,47.94 U$6.1A
  Bottom 1.27: v32.5,44.5 13,44.5 10.5,42 9,42 8.95,41.95 X-MOT.3 JP2.3
N$27
  Bottom 1.27: 8.99,44.49 9,44.5 | 8.99,44.49 9.99,44.49 12,46.5 32.1,46.5 U$6.1B | 8.99,44.49 X-MOT.4 JP2.4
N$28  (via drill 0.6)
  Top 1.27: v27,24.5 27,32.5 U$7.2B
  Bottom 1.27: v27,24.5 11,24.5 Y-MOT.1 4.83,19.36 JP7.1
N$29  (via drill 0.6)
  Top 1.27: v29,26.5 29,32.54 U$7.2A
  Bottom 1.27: v29,26.5 10,26.5 Y-MOT.2 JP7.2
N$30  (via drill 0.6)
  Top 1.27: v31,28.5 31,32.08 U$7.1A
  Bottom 1.27: v31,28.5 9,28.5 Y-MOT.3 JP7.3
N$31
  Bottom 0.813: U$7.MS3 29.33,20.83 32.5,24 38.59,24 JP5.5
N$32  (via drill 0.6)
  Top 0.406: R2.1 27.76,60.64 R1.1 18.41,60.64 16,58.17 v9.78,58.17
  Bottom 0.406: v9.78,58.17 9.02,58.13 XBEE.3
N$33
  Top 0.61: 37.87,28.63 45.32,28.63
  Top 0.813: JP5.1 37.87,28.63 | 45.32,28.63 R8.1
  Bottom 0.813: U$7.MS1 24.25,21.25 26,23 27.5,23 31.5,27 36.51,27 JP5.1
N$36
  Bottom 1.27: U$7.1B 34.5,32.62 34.5,30.5 8,30.5 Y-MOT.4 JP7.4
N$46
  Top 0.152: D13.A 26.67,57.15 | R12.1 29.21,57.15
  Top 0.457: 26.67,57.15 26.87,56.95 R12.1
RESET  (via drill 0.6, 0.6 pad 1.02)
  Top 0.406: Q1.3 32.64,62.23 34.16,60.71 35.94,60.71 37.59,62.48 37.59,69.85 37.34,70.1 35.56,70.1 35.31,69.85 Q2.3
  Top 0.5: v48.39,18.92 48.39,23.11 47.12,24.38 47.12,30.73 46.23,31.62 46.23,44.58 45.34,45.59 v45.21,45.59 | v38.1,11.43 38.1,17.65 38.73,18.29 43.94,18.29 v44.58,18.92
  Bottom 0.406: U1.RES 35.43,6.31 | 31.7,2.56 24.08,2.56 S2.4 S2.3
  Bottom 0.457: 40.39,58.55 38.61,60.45 34.33,60.45 Q1.3
  Bottom 0.5: 31.7,2.56 U1.RES | v45.21,45.59 42.67,48.13 40.39,50.55 40.39,58.55 | 35.43,6.31 36.66,6.31 38.1,7.75 v38.1,11.43 | v44.58,18.92 v48.39,18.92
SCL
  Top 0.406: U1.D21 86.36,52.32 85.09,53.59 83.06,53.59 82.55,53.09 82.55,43.18 I2C.4 79.76,40.39 79.76,33.4 80.77,32.51 88.9,32.51 R22.1
SD_CS  (via drill 0.6, 0.6 pad 1.02)
  Top 0.406: R31.1 75.35,14.9 74.17,13.72 | v73.41,13.72 74.17,13.72 | v57.15,13.72 57.15,53.98 v53.34,57.78 | 74.17,13.72 74.17,11.34 R32.1
  Bottom 0.406: v57.15,13.72 v73.41,13.72 | v53.34,57.78 JP6.36
SD_DIN  (via drill 0.6, 0.6 pad 1.02)
  Top 0.406: R29.1 v65.02,15.24 65.02,11.18 66.04,10.16 R30.1 | v56.13,56.26 59.69,52.7 v59.69,15.24
  Bottom 0.406: v59.69,15.24 v65.02,15.24 | JP6.34 55.88,68.58 56.52,67.94 56.52,57.28 56.52,56.64 v56.13,56.26
SD_SCK  (via drill 0.6, 0.6 pad 1.02)
  Top 0.406: R34.1 81.7,13.63 v80.77,12.7 | v54.61,12.7 54.61,15.11 55.88,16.38 55.88,33.02 54.61,34.29 54.61,41.27 53.85,42.04 v53.85,44.32 | v79.76,10.16 R33.1
  Bottom 0.406: v54.61,12.7 v80.77,12.7 79.76,11.68 v79.76,10.16 | JP6.32 57.15,72.39 57.15,45.72 56.26,44.96 54.48,44.96 v53.85,44.32
SDA
  Top 0.406: 83.82,49.21 U1.D20 | I2C.3 82.68,40.77
  Top 0.457: 82.68,40.77 83.82,41.91 83.82,49.15 | 83.82,49.15 83.82,49.21 | R21.1 85.03,49.15 83.82,49.15
SERV1
  Top 0.406: SER1.3 41.65,67.17 39.88,65.41 39.88,61.59 38.35,60.07 31.11,60.07 30.23,59.18 30.23,50.8 30.73,50.29 34.67,50.29 35.31,50.93 35.31,52.96 36.07,53.72 37.55,53.72 U1.D9
SERV2
  Bottom 0.406: U1.D10 36.58,54.36 38.48,56.26 38.48,58.67 37.59,59.56 33.02,59.56 31.24,61.34 31.24,63.5 29.84,64.9 21.46,64.9 20.7,65.66 20.7,66.29 21.46,67.06 37.21,67.06 40.01,69.85 43.43,69.85 44.2,69.09 44.2,67.22 SER2.3
SPI_MISO  (via drill 0.6 pad 1.02)
  Top 0.406: v58.42,67.31 58.42,65.28 56.9,63.75 53.98,63.75 53.34,63.12 53.34,61.59 62.23,52.7 62.23,32.13 61.85,31.75 61.85,25.15 62.23,24.77 64.14,22.86 66.04,22.86 AUX3.3
  Bottom 0.406: AUX3.3 68.58,25.4 83.06,25.4 83.82,24.64 83.82,23.37 91.95,15.24 91.95,14.48 92.46,13.97 93.9,13.97 U1.D50 | v58.42,67.31 58.42,71.12 JP6.30
SPI_MOSI  (via drill 0.6 pad 1.02)
  Top 0.406: 68.58,25.4 70.36,25.4 71.12,24.64 71.12,23.37 75.18,19.3 84.58,19.3 v91.19,12.7 | 68.58,25.4 AUX3.4 | R29.2 69.43,22.26 68.58,23.11 68.58,25.4
  Bottom 0.406: U1.D51 96.52,13.97 95.25,12.7 v91.19,12.7
SPI_SCK  (via drill 0.6)
  Top 0.406: AUX3.5 69.85,23.37 74.93,18.29 82.3,18.29 83.31,17.27 83.31,15.33 R34.2 86.7,11.94 v89.92,11.94
  Bottom 0.406: U1.D52 90.34,11.51 v89.92,11.94
SPI_SS  (via drill 0.6, 0.6 pad 1.02)
  Top 0.406: v90.42,10.16 86.87,10.16 85.34,11.68 78.74,11.68 76.96,13.46 76.96,15.15 R31.2 v79.38,15.24 | AUX3.6 69.85,26.8 71.37,28.32 73.79,28.32 74.42,27.69 74.42,24.13 v74.93,23.62
  Bottom 0.406: U1.D53 96.52,11.43 95.25,10.16 v90.42,10.16 | v79.38,15.24 79.38,18.41 v74.93,23.62
TFT_CS
  Top 0.406: JP6.29 59.69,74.93 R27.2
TFT_LEDA
  Top 0.406: R26.2 49.53,74.93 JP6.37
TFT_RD
  Top 0.406: JP6.11 85.09,74.93 R13.2
TFT_REST
  Top 0.406: JP6.33 54.61,74.93 R28.2
TFT_RS
  Top 0.406: JP6.7 90.17,74.93 R10.2
TFT_WR
  Top 0.406: JP6.9 87.63,74.93 R11.2
VCC  (via drill 0.6, 0.6 pad 1.02)
  Top 0.406: 88.83,39.12 R22.2 | 86.36,43.94 v86.36,44.32 | IC1.8 23.17,70.05 24.13,69.09 24.13,67.31 22.86,66.04 v21.84,66.04 | v45.97,56.13 45.97,56.01 43.81,53.85 43.81,49.3 44.57,48.54
  Top 0.813: JP4.2 36.82,48.68 U$6.VDD | 36.87,32.63 U$7.VDD | Y-.3 Y+.3 X-.3 X+.3 73.66,31.75 74.93,30.48 | 74.93,30.48 75.69,29.72 75.69,25.91 AUX-2.1 | 88.83,39.12 87.38,39.12 82.55,34.29 I2C.1 | AUX3.1 63.12,25.78 63.12,29.46 64.14,30.48 74.93,30.48 | v55.88,43.18 R18.1
  Top 1.016: R22.2 88.9,41.4 86.36,43.94 | v86.36,44.32 R21.2
  Top 1.1: JP5.2 36.87,32.63
  Top 1.27: U1.5V@0 38.1,2.4 | 27.49,7.12 26.26,8.35 | 27.49,7.12 27.49,5.05 R41.2 | 31.25,2.24 31.25,6.37 30.5,7.12 27.49,7.12
  Top 1.422: R19.1 17.89,20.34 17.89,12.34 18.16,11.94 19.74,11.94 C1.+ 25.14,10.33 IC2.3 26.26,9.21 26.26,8.35
  Top 1.5: 38.1,2.4 39,1.5 47.75,1.5 48.25,2.25 48.25,12.81 49.91,14.61 50.8,15.62 v50.8,27.3 50.8,32.38 v49.4,33.78 49.4,46.61 47.5,48.51 44.57,48.54 44.49,48.54 JP4.6 | 38.1,2.6 37,1.5 33,1.5 31.25,2.24
  Top 2.1: 38.1,2.6 U1.5V@0
  Bottom 0.152: U1.5V@1 93.98,52.7
  Bottom 0.406: v21.84,66.04 40.29,66.04 SER1.2 | v45.97,56.13 45.97,63.25
  Bottom 0.5: A-OUT.1 53.47,39.37 | SER2.2 SER1.2 | SER2.2 | SER2.2 44.59,64.64 45.97,63.25
  Bottom 0.813: U1.5V@1 U1.5V@2 | A-OUT.1 SERIAL.1 53.34,32.64 56.83,29.02 | X+.3 I2C.1 | AUX3.1 61.85,24.13 56.83,29.02 | v50.8,27.3 55.24,27.3 56.83,29.02 | 53.47,39.37 55.88,41.78 v55.88,43.18
  Bottom 1.016: 93.98,52.7 93.98,54.48 | U1.5V@1 91.06,49.23 91.06,47.75 87.63,44.32 v86.36,44.32
  Bottom 1.1: JP4.2 JP4.4 JP4.6 | JP5.2 JP5.4 JP5.6 49.73,29.9 v50.8,27.3
  Bottom 1.27: 93.98,54.48 93.98,66.55 92.96,67.31 92.96,70.48 94.23,71.75 97.54,71.75 98.55,72.77 98.55,77.22 97.41,78.36 94.61,78.36 93.98,77.72 JP6.3
X-DIR
  Bottom 0.5: U1.D5 48.9,50.29 48.9,40.89 46.86,38.86 42.24,38.86 U$6.DIR
X-EN  (via drill 0.6 pad 1.02)
  Top 0.406: U1.D3 R18.2
  Top 0.5: U$6.EN 21.66,34.84 22,34.5 35,34.5 35.63,35.13 35.63,37.02 36.32,37.72 43.56,37.72 v44.83,36.45
  Top 0.813: U$6.EN 21.66,36.16
  Bottom 0.5: v44.83,36.45 46.86,36.45 50.8,40.26 50.8,46.94 U1.D3
X-MAX
  Top 0.406: X+.1 73.66,41.91 76.2,44.45 U1.D17
X-MIN
  Top 0.406: X-.1 71.12,43.18 73.66,45.59 U1.D16
X-STEP  (via drill 0.6 pad 1.02)
  Top 0.6: U$6.STEP 36.9,36 38.1,34.8 v41.53,34.8
  Bottom 0.5: U1.D4 53.34,52.07 49.78,48.51 49.78,40.51 47.24,37.97 43.94,37.97 v41.53,34.8
XBEE_ON  (via drill 0.6)
  Top 0.406: R6.1 14.74,60.85 v16,62.11
  Bottom 0.406: v16,62.11 16,76.87 XBEE.13
Y-DIR  (via drill 0.6 pad 1.02)
  Top 0.406: v47.37,45.59 47.37,32.13 48.51,30.99 v48.51,25.78
  Bottom 0.406: U1.D8 41.66,51.31 v47.37,45.59 | v48.51,25.78 42.93,25.78 39.5,22.23 39.5,20.13 U$7.DIR
Y-EN  (via drill 0.6 pad 1.02)
  Top 0.406: 51.82,48.51 51.82,35.31 54.48,32.64 54.48,29.08
  Top 0.5: R19.2 21.95,19.71 23.11,18.54 34.92,18.54 35.69,19.3 35.69,20.45 38.1,22.86 43.18,22.86 v44.2,21.84 | U1.D6 48.26,52.07 51.82,48.51 | v54.48,22.86 54.48,29.08
  Top 1.422: U$7.EN 21.79,20.01 22.1,20.32 22.1,22.35 R19.2
  Bottom 0.5: v44.2,21.84 49.78,21.84 51.44,21.84 52.45,22.86 v54.48,22.86
Y-MAX
  Top 0.406: Y+.1 68.58,42.29 71.12,44.83 U1.D15
Y-MIN
  Top 0.406: Y-.1 66.04,41.91 68.58,44.2 U1.D14
Y-STEP  (via drill 0.6 pad 1.02)
  Top 0.5: U1.D7 45.72,52.07 47.5,50.29 48.51,50.29 50.93,47.88 50.93,34.8 53.34,32.38 v53.34,20.32 | v42.04,21.46 38.23,21.46 36.95,19.95 U$7.STEP
  Bottom 0.5: v42.04,21.46 43.18,20.32 v53.34,20.32

### Text on the board
_tsilk: 1 | Servo1 | Servo2 | IDTDB02 | S | + | - | Polarshield v1.0 | www.polargraph.co.uk | 2012.05.09 #11153 | 1 | MOTORA | A-OUT | D1 | D0 | Y+ | X+ | A | MS1 | MS2 | MS3 | END STOPS | SCL | SDA | S | + | - | GND | GND | A3 | A4 | + | + | MOSI | + | GND | A9 | D40 | D42 | A11 | MOTORB | D49 | SS | NC | SERIAL | AUX-2 | AUX-3 | B | MS1 | MS2 | MS3 | VCC | A5 | A10 | D44 | A12 | VCC | MISO | SCK | GND | + | + | + | GND | +
_bsilk: 1 | Polarshield v1.0 | www.polargraph.co.uk | + | + | + | GND